# EAGLE design untitled (EAGLE 6.2)
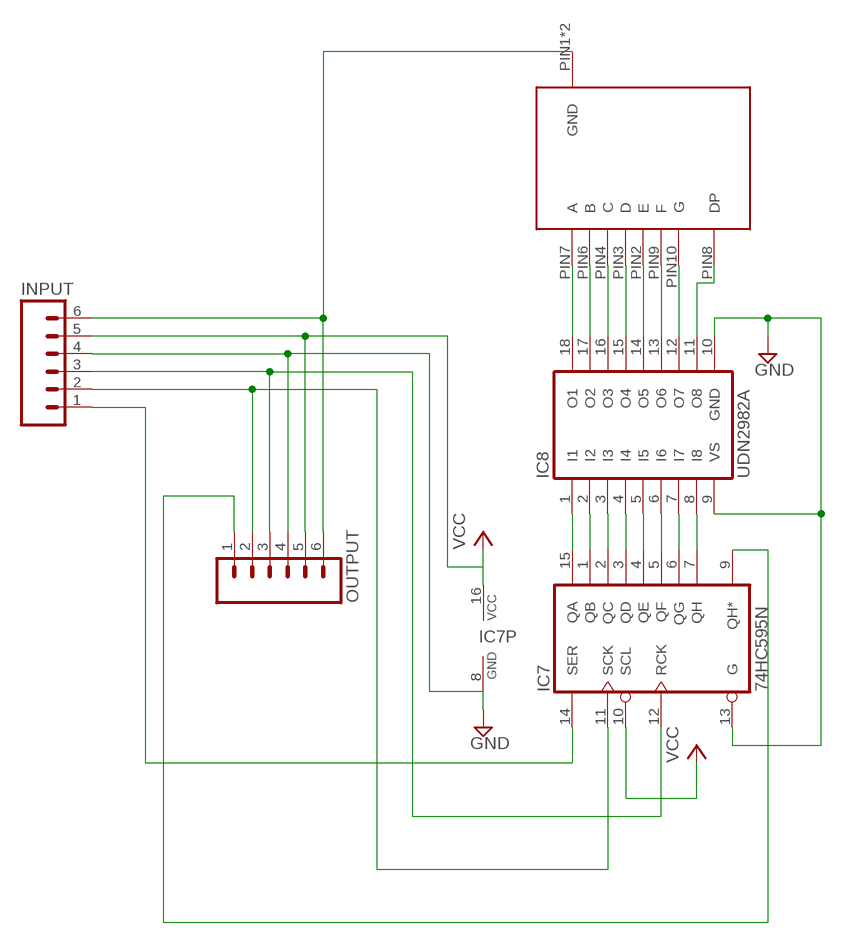
[diagram p0: schematic, sheet 1]

## Parts
IC7  74HC595N  [DIL16]
IC8  UDN2982A  [DIL18]
INPUT  M06LOCK  [1X06_LOCK]
OUTPUT  M06LOCK  [1X06_LOCK]
U$1  LSD2325  [10PIN]

## Nets
5: IC7.16(VCC) INPUT.5 OUTPUT.5 ; supply symbol labelled VCC
GND: IC7.8(GND) IC7.13(G) IC8.9(VS) IC8.10(GND) INPUT.4 OUTPUT.4
N$2: IC7.14(SER) INPUT.1
N$3: IC7.9(QH*) OUTPUT.1
N$5: IC7.11(SCK) INPUT.2 OUTPUT.2
N$6: IC7.12(RCK) INPUT.3 OUTPUT.3
N$10: INPUT.6 OUTPUT.6 U$1.PIN1(GND) U$1.PIN5(GND)
N$56: IC7.15(QA) IC8.1(I1)
N$57: IC7.1(QB) IC8.2(I2)
N$58: IC7.2(QC) IC8.3(I3)
N$59: IC7.3(QD) IC8.4(I4)
N$60: IC7.4(QE) IC8.5(I5)
N$61: IC7.5(QF) IC8.6(I6)
N$62: IC7.6(QG) IC8.7(I7)
N$63: IC7.7(QH) IC8.8(I8)
N$64: IC8.12(O7) U$1.PIN10(G)
N$65: IC8.13(O6) U$1.PIN9(F)
N$66: IC8.14(O5) U$1.PIN2(E)
N$67: IC8.11(O8) U$1.PIN8(DP)
N$68: IC8.15(O4) U$1.PIN3(D)
N$69: IC8.18(O1) U$1.PIN7(A)
N$70: IC8.16(O3) U$1.PIN4(C)
N$77: IC8.17(O2) U$1.PIN6(B)
VCC: IC7.10(SCL)

## Library data of the parts
IC7 = 74xx-eu:74*595: 8-bit SHIFT REGISTER, output latch
IC8 = uln-udn:UDN298*: DRIVER ARRAY Source: Allegro Microsystems Inc. / UDN2981-UDN2984.pdf
INPUT OUTPUT = SparkFun:M06: Header 6 Standard 6-pin 0.1" header. Use with straight break away headers (SKU : PRT-00116), right angle break away headers (PRT-00553), swiss pins (PRT-00743), machine pins (PRT-00117), and female headers (PRT-00115). Molex polarized connector foot print use with SKU : PRT-08094 with associated crimp pins and housings. NOTES ON THE VARIANTS LOCK and LOCK_LONGPADS... This footprint was designed to help hold the alignment of a through-hole component (i.e. 6-pin header) while soldering it into place. You may notice that each hole has been shifted either up or down by 0.005 of an inch from it's more standard position (which is a perfectly straight line). This slight alteration caused the pins (the squares in the middle) to touch the edges of the holes. Because they are alternating, it causes a "brace" to hold the component in place. 0.005 has proven to be the perfect amount of "off-center" position when using our standard breakaway headers. Although looks a little odd when you look at the bare footprint, once you have a header in there, the alteration is very hard to notice. Also, if you push a header all the way into place, it is covered up entirely on the bottom side. This idea of altering the position of holes to aid alignment will be further integrated into the Sparkfun Library for other footprints. It can help hold any component with 3 or more connection pins.
U$1 = 7Seg Library:LSD2325

## Board
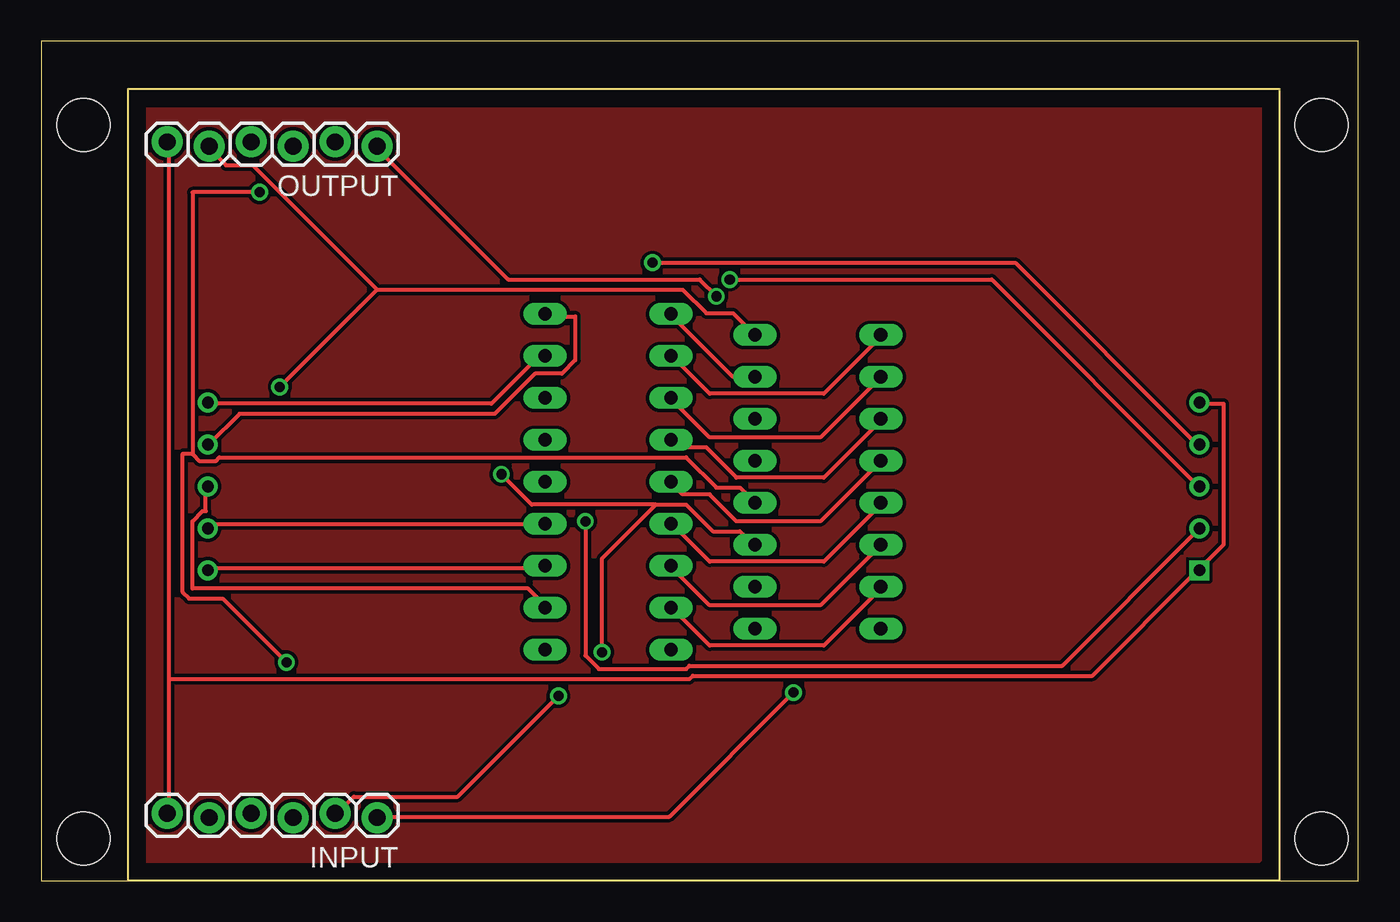
[diagram p1: board, top side]
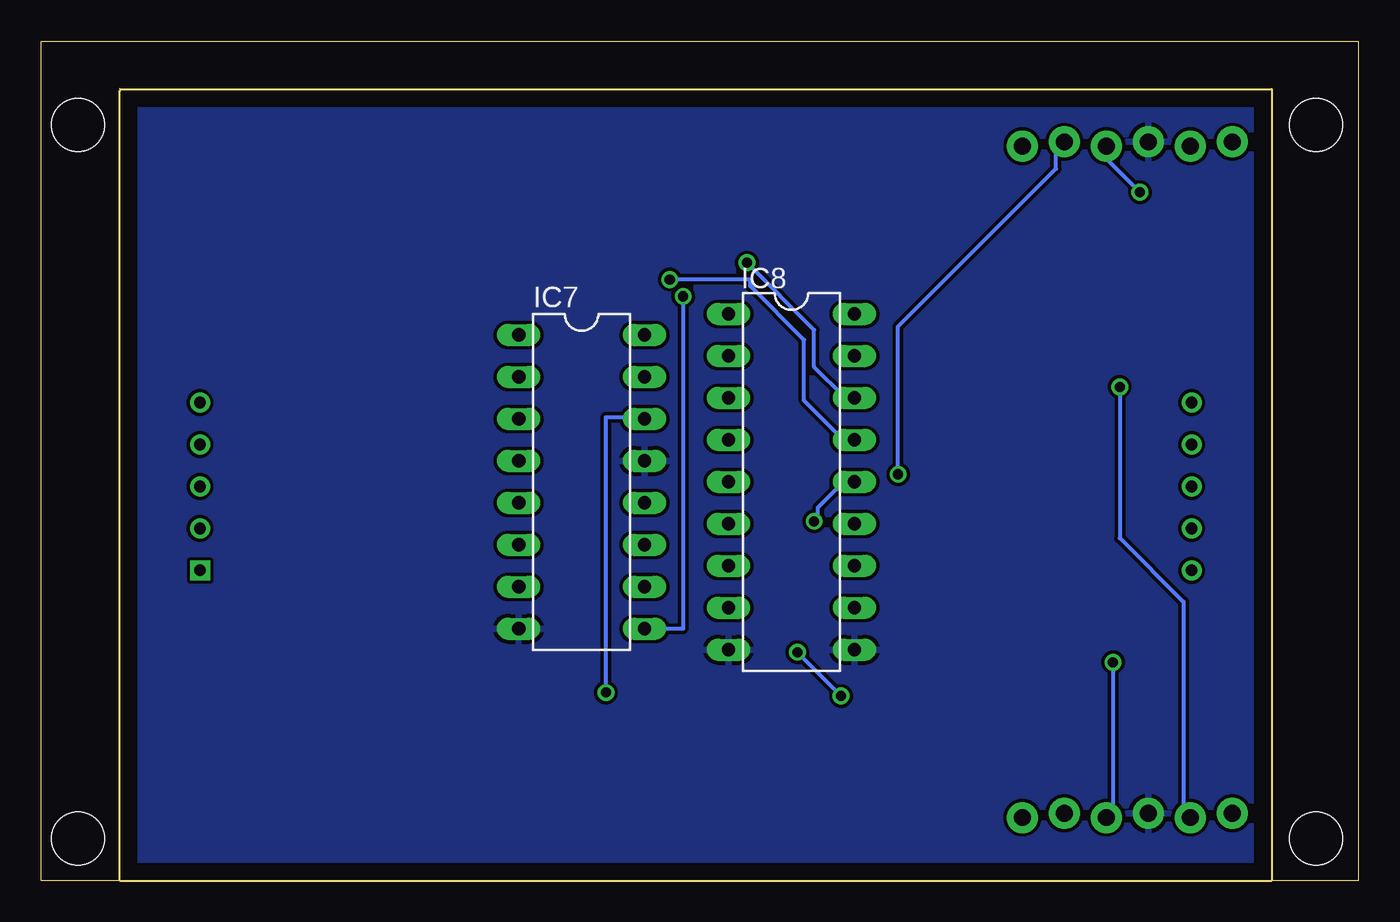
[diagram p2: board, bottom side, seen from below]

Size 79.68 x 50.79 mm. Coordinates in mm from the lower left corner, seen from the top.
Outline: 0,0 79.68,0 79.68,50.79 0,50.79 0,0
Copper layers (1*16): Top 0.035mm / dielectric 1.5mm / Bottom 0.035mm
Design rules: minimum track width 10mil, minimum drill 24mil, track to track 8mil, track to pad 8mil, pad to pad 8mil, via to via 8mil, smd to smd 8mil, copper to edge 40mil, drill to drill 8mil, minimum pad ring 10mil, minimum via ring 8mil, stop-mask expansion 4mil, vias tented up to drill 0mil, thermal gap 10mil
Holes 3.2 mm at 2.54,45.72 2.54,2.54 77.47,2.54 77.47,45.72

### Footprints (pad centres in the part's own frame; a part is rotated, then mirrored left to right if it is on the bottom)
DIL16 = drill 0.813 long: 1 -8.89,-3.81; 2 -6.35,-3.81; 3 -3.81,-3.81; 4 -1.27,-3.81; 5 1.27,-3.81; 6 3.81,-3.81; 7 6.35,-3.81; 8 8.89,-3.81; 9 8.89,3.81; 10 6.35,3.81; 11 3.81,3.81; 12 1.27,3.81; 13 -1.27,3.81; 14 -3.81,3.81; 15 -6.35,3.81; 16 -8.89,3.81
DIL18 = drill 0.813 long: 1 -10.16,-3.81; 2 -7.62,-3.81; 3 -5.08,-3.81; 4 -2.54,-3.81; 5 0,-3.81; 6 2.54,-3.81; 7 5.08,-3.81; 8 7.62,-3.81; 9 10.16,-3.81; 10 10.16,3.81; 11 7.62,3.81; 12 5.08,3.81; 13 2.54,3.81; 14 0,3.81; 15 -2.54,3.81; 16 -5.08,3.81; 17 -7.62,3.81; 18 -10.16,3.81
1X06_LOCK = drill 1.016 pad 1.88: 1 0,0; 2 2.54,-0.254; 3 5.08,0; 4 7.62,-0.254; 5 10.16,0; 6 12.7,-0.254
10PIN = drill 0.7 square: PIN1 18.77,4.85 | drill 0.7: PIN2 21.31,4.85; PIN3 23.85,4.85; PIN4 26.39,4.85; PIN5 28.93,4.85; PIN6 28.93,64.85; PIN7 26.39,64.85; PIN8 23.85,64.85; PIN9 21.31,64.85; PIN10 18.77,64.85

### Placement (x,y rotation side)
IC7  46.99,24.13 270 bottom
IC8  34.29,24.13 270 bottom
INPUT  20.32,3.81 180 top
OUTPUT  20.32,44.45 180 top
U$1  74.93,0 90 top

### Tracks (layer width: path | path; a pad name or v marks a point on that pad's centre or on a via)
5  (via drill 0.61)
  Top 0.254: IC7.16 41.86,34.34 40.23,34.34 38.81,35.76 20.32,35.76 | 20.32,35.76 12.8,43.28 11.18,43.28 10.16,44.3 OUTPUT.5 | 20.32,35.76 v14.43,29.87
  Bottom 0.254: v14.43,29.87 14.43,20.73 10.57,16.87 10.57,4.27 10.16,3.86 INPUT.5
GND
  pour Bottom: 5.08,48.26 74.93,48.26 74.93,0 5.08,0
N$1
  pour Top: 6.35,46.99 73.66,46.99 73.66,1.27 6.35,1.27
N$2  (via drill 0.61)
  Top 0.254: v45.52,11.38 38,3.86 20.32,3.86 INPUT.1
  Bottom 0.254: v45.52,11.38 45.52,28.04 43.28,28.04 IC7.14
N$3  (via drill 0.61)
  Top 0.254: v40.84,35.36 39.83,36.37 28.25,36.37 20.32,44.3 OUTPUT.1
  Bottom 0.254: IC7.9 40.84,15.24 v40.84,35.36
N$5  (via drill 0.61)
  Top 0.254: 37.19,22.76 39.01,22.76 40.64,21.13 42.27,21.13 43.08,20.32 IC7.11 | 37.19,22.76 33.93,19.51 v33.93,13.82 | v31.29,11.18 25.2,5.08 18.9,5.08 17.88,4.06 INPUT.2 | v27.84,24.59 29.67,22.76 37.19,22.76
  Bottom 0.254: v31.29,11.18 v33.93,13.82 | v27.84,24.59 27.84,33.53 18.29,43.08 18.29,44.3 17.88,44.7 OUTPUT.2
N$6  (via drill 0.61)
  Top 0.254: IC7.12 42.27,23.77 40.84,23.77 39.01,25.6 10.77,25.6 10.57,25.4 9.55,25.4 9.14,25.81 | 9.14,25.81 9.14,41.66 v13.21,41.66 | v14.83,13.21 10.97,17.07 8.94,17.07 8.53,17.48 8.53,25.81 9.14,25.81
  Bottom 0.254: v13.21,41.66 15.24,43.69 OUTPUT.3 | v14.83,13.21 14.83,4.27 15.24,3.86 INPUT.3
N$10
  Top 0.254: U$1.PIN5 70.1,28.85 71.53,28.85 71.53,20.32 70.1,18.9 U$1.PIN1 69.9,18.69 63.6,12.39 39.42,12.39 39.22,12.19 7.72,12.19 | 7.72,12.19 7.72,44.7 OUTPUT.6 | 7.72,12.19 7.72,4.06 INPUT.6
N$56
  Top 0.254: IC7.15 41.86,30.48 38.2,34.14 IC8.1
N$57
  Top 0.254: IC8.2 38.2,31.7 40.44,29.46 47.35,29.46 50.8,32.92 IC7.1
N$58
  Top 0.254: IC7.2 47.14,26.82 40.44,26.82 38.2,29.06 IC8.3
N$59
  Top 0.254: IC8.4 38.2,26.62 38.61,26.21 40.23,26.21 42.06,24.38 47.35,24.38 50.8,27.84 IC7.3
N$60
  Top 0.254: IC7.4 47.14,21.74 42.06,21.74 40.44,23.37 38.81,23.37 38.2,23.98 IC8.5
N$61
  Top 0.254: IC8.6 38.2,21.54 40.44,19.3 47.35,19.3 50.8,22.76 IC7.5
N$62
  Top 0.254: IC7.6 47.14,16.66 40.44,16.66 38.2,18.9 IC8.7
N$63
  Top 0.254: IC8.8 38.2,16.46 40.44,14.22 47.35,14.22 50.8,17.68 IC7.7
N$64
  Top 0.254: U$1.PIN10 10.16,18.9 30.48,18.9 IC8.12
N$65
  Top 0.254: U$1.PIN9 10.16,21.34 10.36,21.54 30.48,21.54 IC8.13
N$66  (via drill 0.61)
  Top 0.254: v32.92,21.74 32.92,13.61 33.73,12.8 39.01,12.8 39.22,13.01 61.77,13.01 69.9,21.13 U$1.PIN2
  Bottom 0.254: v32.92,21.74 32.72,21.95 32.72,22.55 31.29,23.98 30.48,23.98 IC8.14
N$67
  Top 0.254: U$1.PIN8 9.96,23.77 9.96,22.35 9.75,22.35 9.14,21.74 9.14,17.68 29.46,17.68 30.48,16.66 IC8.11
N$68  (via drill 0.61)
  Top 0.254: v41.66,36.37 57.51,36.37 69.9,23.98 U$1.PIN3
  Bottom 0.254: v41.66,36.37 36.78,36.37 36.78,35.97 33.53,32.72 33.53,29.06 31.29,26.82 30.48,26.82 IC8.15
N$69
  Top 0.254: U$1.PIN7 10.16,26.42 11.99,28.25 27.43,28.25 29.87,30.68 31.5,30.68 32.31,31.5 32.31,34.14 30.48,34.14 IC8.18
N$70  (via drill 0.61)
  Top 0.254: v36.98,37.39 58.93,37.39 69.9,26.42 U$1.PIN4
  Bottom 0.254: v36.98,37.39 32.92,33.33 32.92,31.09 31.09,29.26 30.48,29.26 IC8.16
N$77
  Top 0.254: U$1.PIN6 10.16,28.85 27.23,28.85 30.07,31.7 30.48,31.7 IC8.17